# Altium schematic sheet GPIO_Expander.SchDoc
size A4; SheetNumber: 4; SheetTotal: 7
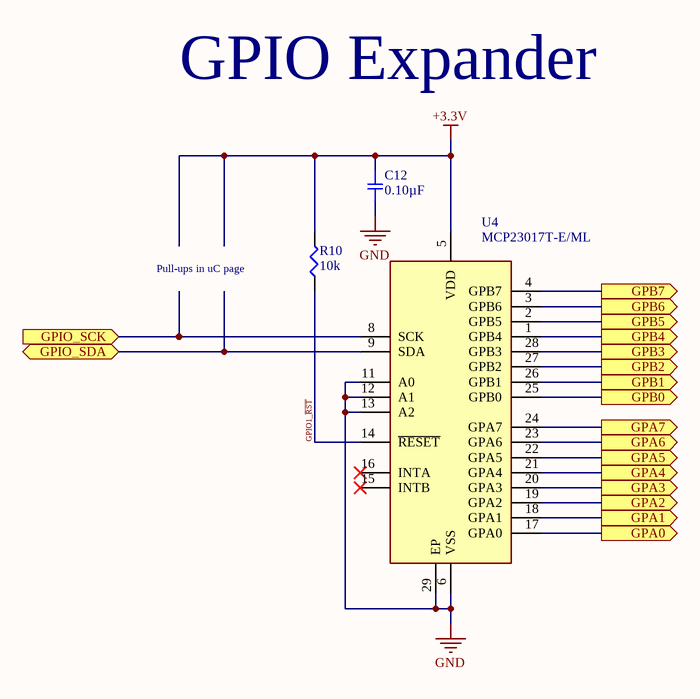
[diagram p0: GPIO_Expander.SchDoc]

## Parts
C12  0.10µF  [SMD-0402C]
R10  10k  [SMD-0402-RES]
U4  MCP23017T-E/ML  [QFN65P600X600X100-29N-D]

## Ports
GPA0 (out), GPA1 (out), GPA2 (out), GPA3 (out), GPA4 (out), GPA5 (out), GPA6 (out), GPA7 (out), GPB0 (out), GPB1 (out), GPB2 (out), GPB3 (out), GPB4 (out), GPB5 (out), GPB6 (out), GPB7 (out), GPIO_SCK (in), GPIO_SDA (bidir)

## Nets
+3.3V: C12.1 R10.2 U4.5(VDD)
GND: C12.2 U4.6(VSS) U4.11(A0) U4.12(A1) U4.13(A2) U4.29(EP)
GPA0: U4.17(GPA0) ; port GPA0
GPA1: U4.18(GPA1) ; port GPA1
GPA2: U4.19(GPA2) ; port GPA2
GPA3: U4.20(GPA3) ; port GPA3
GPA4: U4.21(GPA4) ; port GPA4
GPA5: U4.22(GPA5) ; port GPA5
GPA6: U4.23(GPA6) ; port GPA6
GPA7: U4.24(GPA7) ; port GPA7
GPB0: U4.25(GPB0) ; port GPB0
GPB1: U4.26(GPB1) ; port GPB1
GPB2: U4.27(GPB2) ; port GPB2
GPB3: U4.28(GPB3) ; port GPB3
GPB4: U4.1(GPB4) ; port GPB4
GPB5: U4.2(GPB5) ; port GPB5
GPB6: U4.3(GPB6) ; port GPB6
GPB7: U4.4(GPB7) ; port GPB7
GPIO1_~{RST}: R10.1 U4.14(~{RESET})
GPIO_SCK: U4.8(SCK) ; port GPIO_SCK
GPIO_SDA: U4.9(SDA) ; port GPIO_SDA

Not connected (* = marked no-connect by the designer): U4 7(NC_1) 10(NC_2) 15(INTB)* 16(INTA)*

## Notes on the sheet
- GPIO Expander
- (near R10) Pull-ups in uC page

## Library data of the parts
C12 = GCM155R71C104KA55D: CAP CER 0.1UF 16V X7R 0402; Manufacturer: Murata Electronics North America; Factory Stock: 0; Unit Price (USD): 0.1; Minimum Quantity: 1; Tolerance: ±10%; Datasheets: http://www.murata.com/~/media/webrenewal/support/library/catalog/products/capacitor/mlcc/c03e.ashx; Image: //media.digikey.com/Renders/Murata%20Renders/ZRB-SERIES-0402.jpg; Digi-Key Part Number: 490-4759-1-ND; Part Number: GCM155R71C104KA55D; Quantity Available: 734194; @ qty: 0; Packaging: Cut Tape (CT); Series: GCM; Part Status: Active; Value: 0.10µF; Voltage: 16V; Temperature Coefficient: X7R; Operating Temperature: -55°C ~ 125°C; Features: -; Ratings: AEC-Q200; Applications: Automotive; Mounting Type: Surface Mount, MLCC; Package / Case: 0402 (1005 Metric); Size / Dimension: 0.039" L x 0.020" W (1.00mm x 0.50mm); Height - Seated (Max): -; Thickness (Max): 0.022" (0.55mm); Lead Spacing: -; Lead Style: -
R10 = ERJ-2RKF1002X: RES SMD 10K OHM 1% 1/10W 0402; Manufacturer: Panasonic Electronic Components; Factory Stock: 0; Unit Price (USD): 0.00496; @ qty: 1500; Minimum Quantity: 1; Power (Watts): 0.1W, 1/10W; Temperature Coefficient: ±100ppm/°C; Part Number: ERJ-2RKF1002X; Datasheets: http://industrial.panasonic.com/www-cgi/jvcr13pz.cgi?E+PZ+3+AOA0002+ERJ2RKF1002X+7+WW; Image: //media.digikey.com/Photos/Panasonic%20Photos/ERJ-PA2-Series.jpg; Digi-Key Part Number: P10.0KLCT-ND; Quantity Available: 9922786; Packaging: Cut Tape (CT); Series: ERJ; Part Status: Active; Value: 10k; Tolerance: ±1%; Composition: Thick Film; Features: Automotive AEC-Q200; Operating Temperature: -55°C ~ 155°C; Package / Case: 0402 (1005 Metric); Supplier Device Package: 0402; Size / Dimension: 0.039" L x 0.020" W (1.00mm x 0.50mm); Height - Seated (Max): 0.016" (0.40mm); Number of Terminations: 2; Failure Rate: -
U4 = MCP23017T-E/ML: Interface - I/O Expanders 16bit Input/Output Exp I2C interface; Manufacturer_Name: Microchip; Datasheet Link: https://datasheet.datasheetarchive.com/originals/distributors/SFDatasheet-4/sf-00090057.pdf; Height: 1mm; Manufacturer_Part_Number: MCP23017T-E/ML; Mouser Part Number: 579-MCP23017T-E/ML; Mouser Price/Stock: https://www.mouser.co.uk/ProductDetail/Microchip-Technology/MCP23017T-E-ML?qs=usxtMOJb1RwLvxs2MXknpg%3D%3D; Arrow Part Number: MCP23017T-E/ML; Arrow Price/Stock: https://www.arrow.com/en/products/mcp23017t-eml/microchip-technology.html?utm_currency=USD&region=nac; Value: MCP23017T-E/ML